# EAGLE design led_12led (EAGLE 7.5.0)
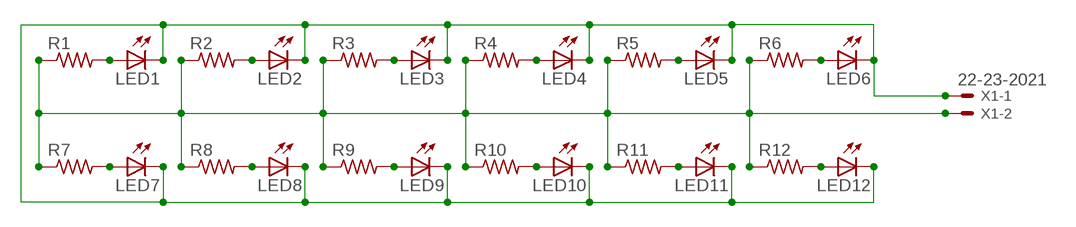
[diagram p0: schematic, sheet 1]

## Parts
LED1  LED3MM  [LED3MM]
LED2  LED3MM  [LED3MM]
LED3  LED3MM  [LED3MM]
LED4  LED3MM  [LED3MM]
LED5  LED3MM  [LED3MM]
LED6  LED3MM  [LED3MM]
LED7  LED3MM  [LED3MM]
LED8  LED3MM  [LED3MM]
LED9  LED3MM  [LED3MM]
LED10  LED3MM  [LED3MM]
LED11  LED3MM  [LED3MM]
LED12  LED3MM  [LED3MM]
R1  R-US_0309/12  [0309/12]
R2  R-US_0309/12  [0309/12]
R3  R-US_0309/12  [0309/12]
R4  R-US_0309/12  [0309/12]
R5  R-US_0309/12  [0309/12]
R6  R-US_0309/12  [0309/12]
R7  R-US_0309/12  [0309/12]
R8  R-US_0309/12  [0309/12]
R9  R-US_0309/12  [0309/12]
R10  R-US_0309/12  [0309/12]
R11  R-US_0309/12  [0309/12]
R12  R-US_0309/12  [0309/12]
X1  22-23-2021  [22-23-2021]

## Nets
N$1: R1.1 R2.1 R3.1 R4.1 R5.1 R6.1 R7.1 R8.1 R9.1 R10.1 R11.1 R12.1 X1.2
N$2: LED1.A R1.2
N$3: LED2.A R2.2
N$4: LED3.A R3.2
N$5: LED4.A R4.2
N$6: LED5.A R5.2
N$7: LED6.A R6.2
N$8: LED7.A R7.2
N$9: LED8.A R8.2
N$10: LED9.A R9.2
N$11: LED10.A R10.2
N$12: LED11.A R11.2
N$13: LED12.A R12.2
N$16: LED1.K(C) LED2.K(C) LED3.K(C) LED4.K(C) LED5.K(C) LED6.K(C) LED7.K(C) LED8.K(C) LED9.K(C) LED10.K(C) LED11.K(C) LED12.K(C) X1.1

## Library data of the parts
LED1-LED12 = led:LED: LED OSRAM: - CHIPLED LG R971, LG N971, LY N971, LG Q971, LY Q971, LO R971, LY R971 LH N974, LH R974 LS Q976, LO Q976, LY Q976 LO Q996 - Hyper CHIPLED LW Q18S LB Q993, LB Q99A, LB R99A - SideLED LS A670, LO A670, LY A670, LG A670, LP A670 LB A673, LV A673, LT A673, LW A673 LH A674 LY A675 LS A676, LA A676, LO A676, LY A676, LW A676 LS A679, LY A679, LG A679 - Hyper Micro SIDELED® LS Y876, LA Y876, LO Y876, LY Y876 LT Y87S - SmartLED LW L88C, LW L88S LB L89C, LB L89S, LG L890 LS L89K, LO L89K, LY L89K LS L896, LA L896, LO L896, LY L896 - TOPLED LS T670, LO T670, LY T670, LG T670, LP T670 LSG T670, LSP T670, LSY T670, LOP T670, LYG T670 LG T671, LOG T671, LSG T671 LB T673, LV T673, LT T673, LW T673 LH T674 LS T676, LA T676, LO T676, LY T676, LB T676, LH T676, LSB T676, LW T676 LB T67C, LV T67C, LT T67C, LS T67K, LO T67K, LY T67K, LW E67C LS E67B, LA E67B, LO E67B, LY E67B, LB E67C, LV E67C, LT E67C LW T67C LS T679, LY T679, LG T679 LS T770, LO T770, LY T770, LG T770, LP T770 LB T773, LV T773, LT T773, LW T773 LH T774 LS E675, LA E675, LY E675, LS T675 LS T776, LA T776, LO T776, LY T776, LB T776 LHGB T686 LT T68C, LB T68C - Hyper Mini TOPLED® LB M676 - Mini TOPLED Santana® LG M470 LS M47K, LO M47K, LY M47K Source: http://www.osram.convergy.de LUXEON: - LUMILED® LXK2-PW12-R00, LXK2-PW12-S00, LXK2-PW14-U00, LXK2-PW14-V00 LXK2-PM12-R00, LXK2-PM12-S00, LXK2-PM14-U00 LXK2-PE12-Q00, LXK2-PE12-R00, LXK2-PE12-S00, LXK2-PE14-T00, LXK2-PE14-U00 LXK2-PB12-K00, LXK2-PB12-L00, LXK2-PB12-M00, LXK2-PB14-N00, LXK2-PB14-P00, LXK2-PB14-Q00 LXK2-PR12-L00, LXK2-PR12-M00, LXK2-PR14-Q00, LXK2-PR14-R00 LXK2-PD12-Q00, LXK2-PD12-R00, LXK2-PD12-S00 LXK2-PH12-R00, LXK2-PH12-S00 LXK2-PL12-P00, LXK2-PL12-Q00, LXK2-PL12-R00 Source: www.luxeon.com KINGBRIGHT: KA-3528ASYC Source: www.kingbright.com
R1-R12 = resistor:R-US_: RESISTOR, American symbol
X1 = con-molex:22-23-2021: .100" (2.54mm) Center Header - 2 Pin; MF: MOLEX; MPN: 22-23-2021; OC_FARNELL: 1462926; OC_NEWARK: 25C3832

## Board
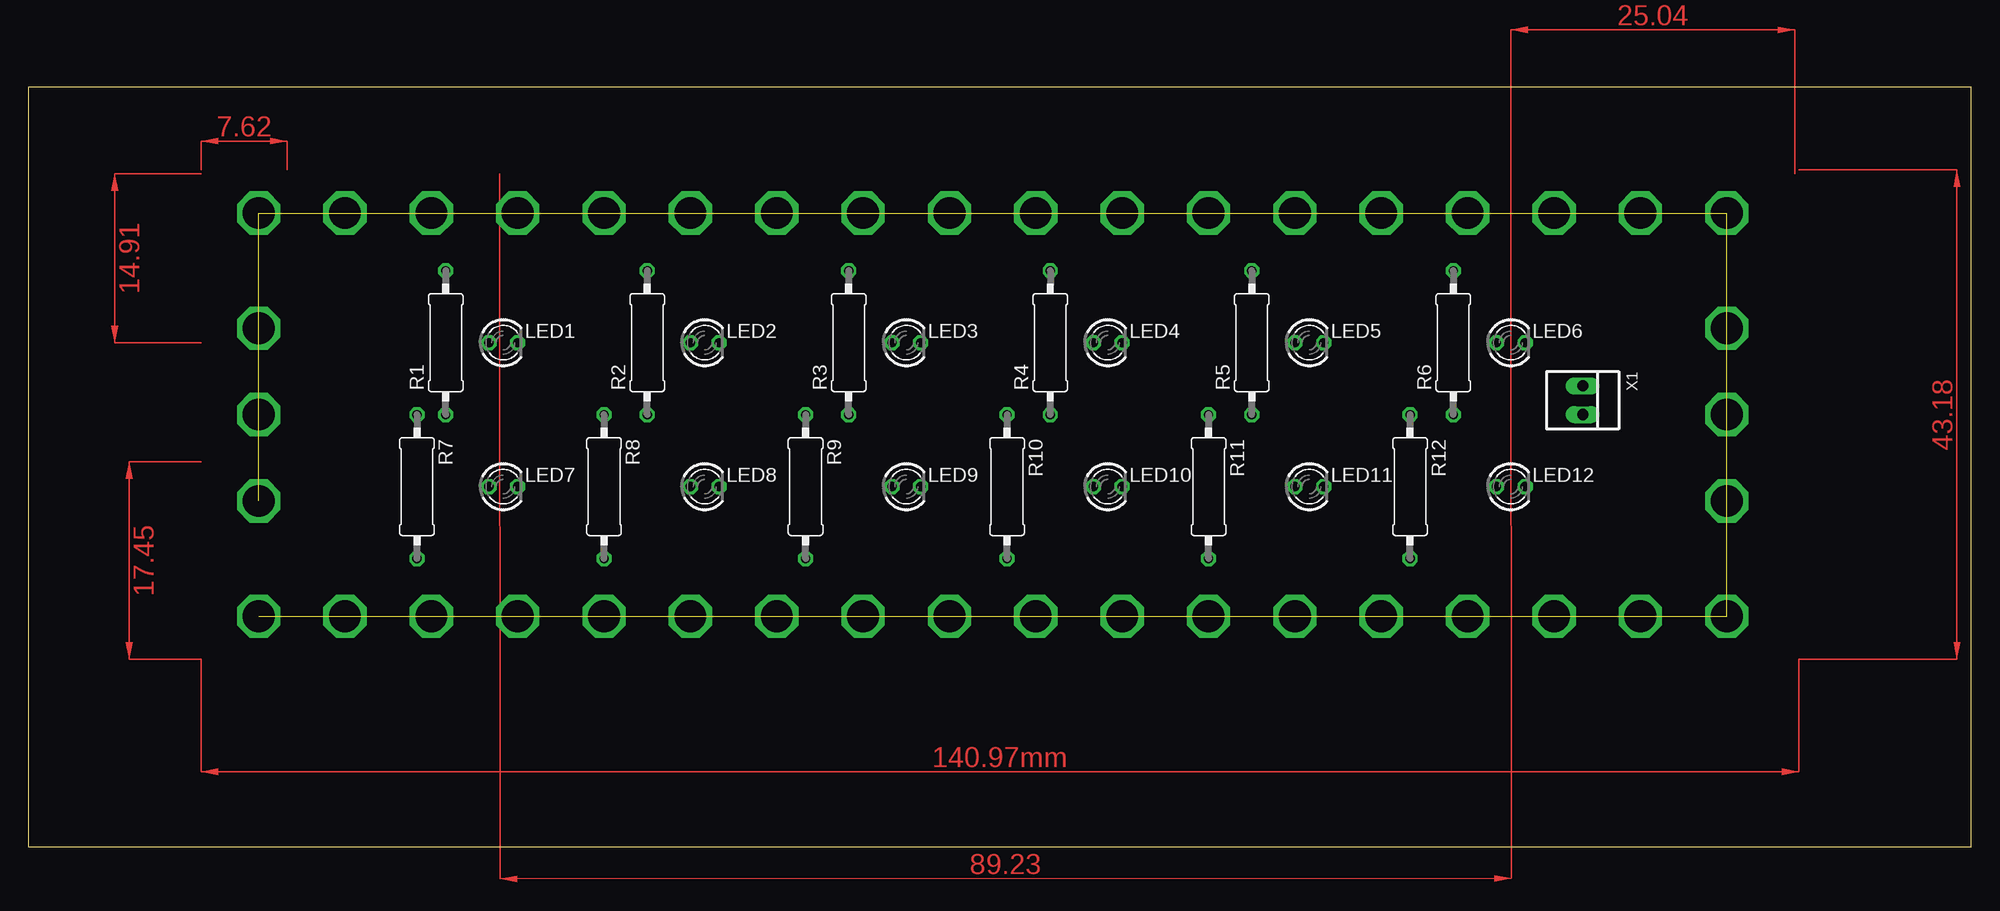
[diagram p1: board, top side]
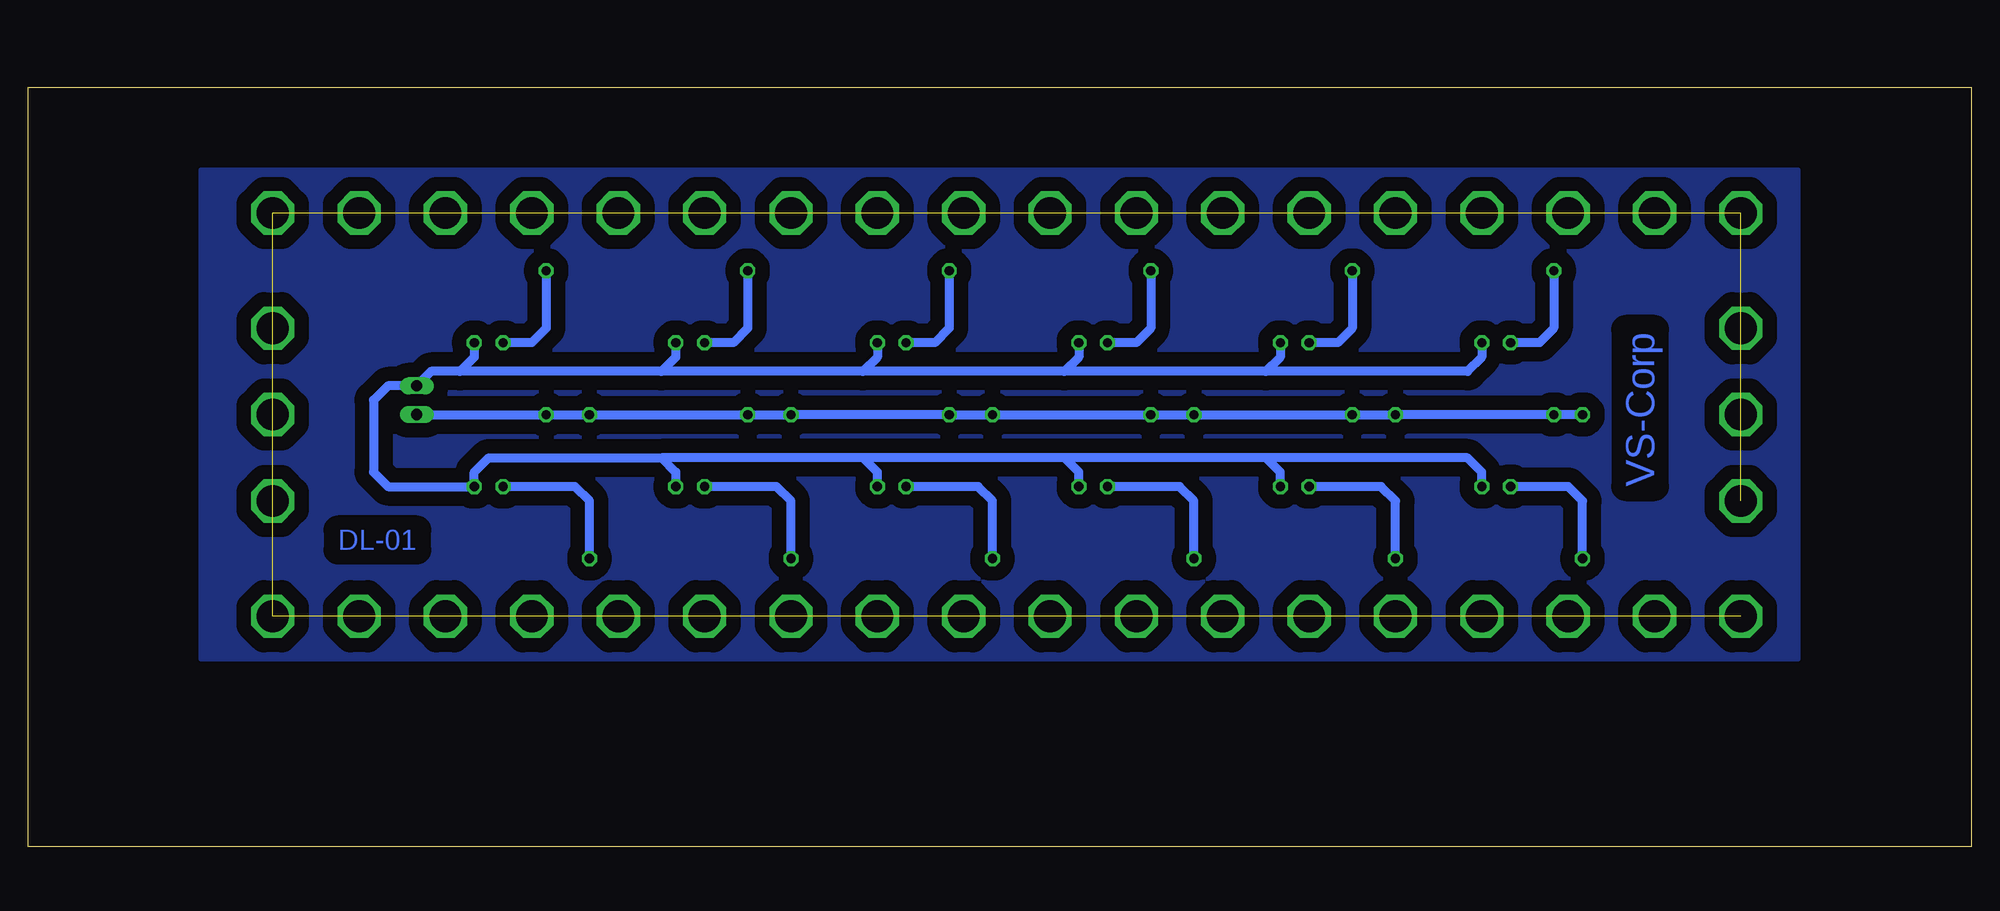
[diagram p2: board, bottom side, seen from below]

Size 171.43 x 66.98 mm. Coordinates in mm from the lower left corner, seen from the top.
Outline: 0,0 171.43,0 171.43,66.98 0,66.98 0,0
Copper layers (1*16): Top 0.035mm / dielectric 1.5mm / Bottom 0.035mm
Design rules "default": minimum track width 10mil, minimum drill 24mil, track to track 8mil, track to pad 8mil, pad to pad 8mil, via to via 8mil, smd to smd 8mil, copper to edge 40mil, drill to drill 8mil, minimum pad ring 10mil, minimum via ring 8mil, stop-mask expansion 4mil, vias tented up to drill 0mil, thermal gap 10mil

### Footprints (pad centres in the part's own frame; a part is rotated, then mirrored left to right if it is on the bottom)
LED3MM = drill 0.813 octagon: A -1.27,0; K 1.27,0
0309/12 = drill 0.813 octagon: 1 -6.35,0; 2 6.35,0
22-23-2021 = drill 1 long: 1 -1.27,0; 2 1.27,0

### Placement (x,y rotation side)
LED1  41.91,44.45 0 top
LED2  59.69,44.45 0 top
LED3  77.47,44.45 0 top
LED4  95.25,44.45 0 top
LED5  113.03,44.45 0 top
LED6  130.81,44.45 0 top
LED7  41.91,31.75 0 top
LED8  59.69,31.75 0 top
LED9  77.47,31.75 0 top
LED10  95.25,31.75 0 top
LED11  113.03,31.75 0 top
LED12  130.81,31.75 0 top
R1  36.83,44.45 90 top
R2  54.61,44.45 90 top
R3  72.39,44.45 90 top
R4  90.17,44.45 90 top
R5  107.95,44.45 90 top
R6  125.73,44.45 90 top
R7  34.29,31.75 270 top
R8  50.8,31.75 270 top
R9  68.58,31.75 270 top
R10  86.36,31.75 270 top
R11  104.14,31.75 270 top
R12  121.92,31.75 270 top
X1  137.16,39.37 270 top

### Tracks (layer width: path | path; a pad name or v marks a point on that pad's centre or on a via)
N$1
  Bottom 0.813: X1.2 R6.1 R12.1 R5.1 R11.1 R4.1 R10.1 R3.1 R9.1 R2.1 R8.1 R1.1 R7.1
N$2
  Bottom 0.813: R1.2 36.83,45.72 38.1,44.45 LED1.A
N$3
  Bottom 0.813: R2.2 54.61,45.72 55.88,44.45 LED2.A
N$4
  Bottom 0.813: R3.2 72.39,45.72 73.66,44.45 LED3.A
N$5
  Bottom 0.813: R4.2 90.17,45.72 91.44,44.45 LED4.A
N$6
  Bottom 0.813: R5.2 107.95,45.72 109.22,44.45 LED5.A
N$7
  Bottom 0.813: R6.2 125.73,45.72 127,44.45 LED6.A
N$8
  Bottom 0.813: R7.2 34.29,30.48 35.56,31.75 LED7.A
N$9
  Bottom 0.813: R8.2 50.8,30.48 52.07,31.75 LED8.A
N$10
  Bottom 0.813: R9.2 68.58,30.48 69.85,31.75 LED9.A
N$11
  Bottom 0.813: R10.2 86.36,30.48 87.63,31.75 LED10.A
N$12
  Bottom 0.813: R11.2 104.14,30.48 105.41,31.75 LED11.A
N$13
  Bottom 0.813: R12.2 121.92,30.48 123.19,31.75 LED12.A
N$14
  pour Bottom (isolate 1.27): 15.24,59.69 156.21,59.69 156.21,16.51 15.24,16.51 15.24,58.42
N$16
  Bottom 0.813: 115.57,34.29 130.81,34.29 132.08,33.02 LED12.K 139.7,31.75 140.97,33.02 140.97,39.37 139.7,40.64 X1.1 135.89,41.91 133.35,41.91 | 115.57,34.29 114.3,33.02 LED11.K | LED10.K 96.52,33.02 97.79,34.29 | 97.79,34.29 115.57,34.29 | LED9.K 78.74,33.02 80.01,34.29 | 80.01,34.29 97.79,34.29 | LED8.K 60.96,33.02 62.23,34.29 | 62.23,34.29 80.01,34.29 | LED7.K 43.18,33.02 44.45,34.29 62.23,34.29 | LED1.K 43.18,43.18 44.45,41.91 62.23,41.91 | 62.23,41.91 80.01,41.91 | 80.01,41.91 97.79,41.91 | 97.79,41.91 115.57,41.91 | 115.57,41.91 133.35,41.91 | LED6.K 132.08,43.18 133.35,41.91 | LED5.K 114.3,43.18 115.57,41.91 | LED4.K 96.52,43.18 97.79,41.91 | LED3.K 78.74,43.18 80.01,41.91 | LED2.K 60.96,43.18 62.23,41.91
N$32  (via drill 2.8 pad 1.27)  (41 unrouted)
  other vias: 27.94,55.88 35.56,55.88 43.18,55.88 50.8,55.88 58.42,55.88 66.04,55.88 73.66,55.88 81.28,55.88 88.9,55.88 96.52,55.88 104.14,55.88 111.76,55.88 119.38,55.88 127,55.88 134.62,55.88 142.24,55.88 149.86,55.88 149.86,45.72 149.86,38.1 149.86,30.48 149.86,20.32 142.24,20.32 134.62,20.32 127,20.32 20.32,55.88 119.38,20.32 111.76,20.32 104.14,20.32 96.52,20.32 88.9,20.32 81.28,20.32 73.66,20.32 66.04,20.32 58.42,20.32 50.8,20.32 43.18,20.32 35.56,20.32 27.94,20.32 20.32,20.32 20.32,30.48 20.32,38.1 20.32,45.72
(copper drawn outside any net)
  shapes: Top area x7

### Text on the board
Bottom: VS-Corp | DL-01